# EAGLE design Zio Qwiic Air Pressure Sensor BMP280 (EAGLE 9.1.1)
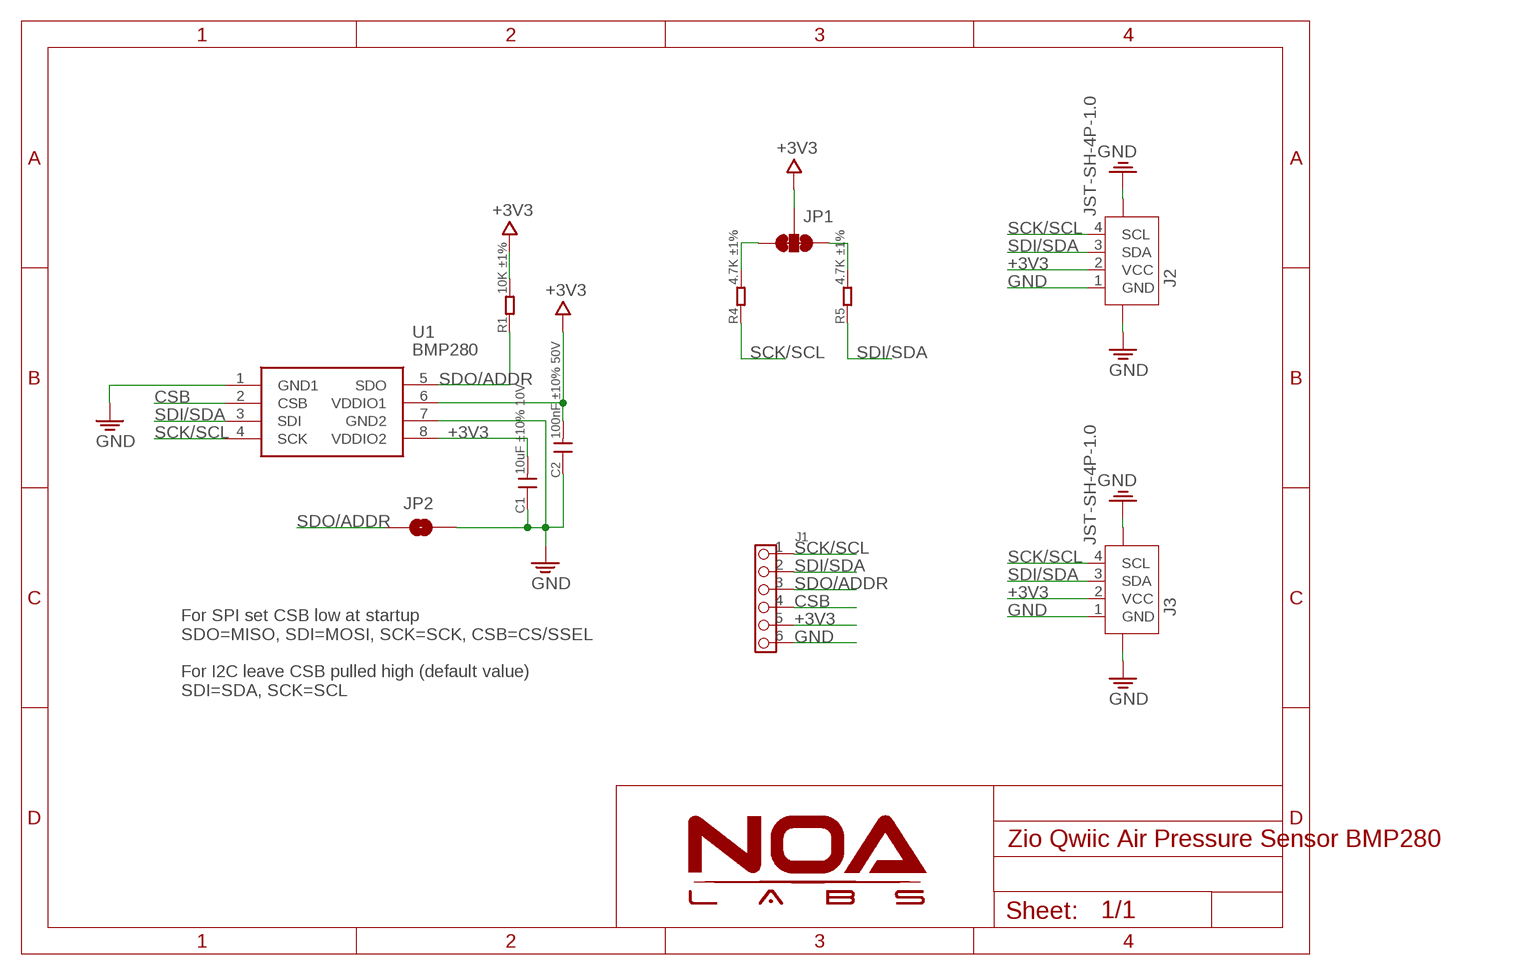
[diagram p0: schematic, sheet 1]

## Parts
C1  10uF ±10% 10V  C-0603  [C0603]
C2  100nF ±10% 50V  C-0603  [C0603]
J1  HEADER-6P-60/35MIL  [6P-2.54-60/35MIL]
J2  JST-SH-4P-1.0  [JST-SH-4P]
J3  JST-SH-4P-1.0  [JST-SH-4P]
JP1  SMT-JUMPER_3_2-NC_TRACE  [SMT-JUMPER_3_2-NC_TRACE]
JP2  JUMPER-SMT_2_NC_PASTE_NOCREM  [SMT-JUMPER_2_NC_PASTE_SILK_NOCREM]
R1  10K ±1%  R-0603  [R0603]
R4  4.7K ±1%  R-0603  [R0603]
R5  4.7K ±1%  R-0603  [R0603]
U1  BMP280  [8-PIN-METAL-LID-LGA]

## Nets
+3V3: C1.2 C2.2 J1.5 J2.2(VCC) J3.2(VCC) JP1.2 R1.2 U1.6(VDDIO1) U1.8(VDDIO2)
CSB: J1.4 U1.2(CSB)
GND: C1.1 C2.1 J1.6 J2.1(GND) J2.NC1 J2.NC2 J3.1(GND) J3.NC1 J3.NC2 JP2.2 U1.1(GND1) U1.7(GND2)
N$6: JP1.3 R4.2
N$8: JP1.1 R5.2
SCK/SCL: J1.1 J2.4(SCL) J3.4(SCL) R4.1 U1.4(SCK)
SDI/SDA: J1.2 J2.3(SDA) J3.3(SDA) R5.1 U1.3(SDI)
SDO/ADDR: J1.3 JP2.1 R1.1 U1.5(SDO)

## Notes on the sheet
- For SPI set CSB low at startup
  SDO=MISO, SDI=MOSI, SCK=SCK, CSB=CS/SSEL
  
  For I2C leave CSB pulled high (default value)
  SDI=SDA, SCK=SCL

## Library data of the parts
C1 C2 = RCL:C
J1 = Connector_NOA:HEADER-6P
J2 J3 = Connector:JST-SH-4P
JP1 = NOA-Jumpers:SMT-JUMPER_3_2-NC_TRACE
JP2 = NOA-Jumpers:JUMPER-SMT_2_NC_PASTE_NOCREM
R1 R4 R5 = RCL:R
U1 = IC_NOA:BMP280: Digital Pressure Sensor Source: Datasheet <https://ae-bst.resource.bosch.com/media/products/dokumente/bmp280/BST-BMP280-DS001-11.pdf>; ARROW_PART_NUMBER: bmp280; DESCRIPTION: Digital Pressure Sensor; HEIGHT: mm; MANUFACTURER_NAME: Bosch Sensortec; MANUFACTURER_PART_NUMBER: bmp280

## Board
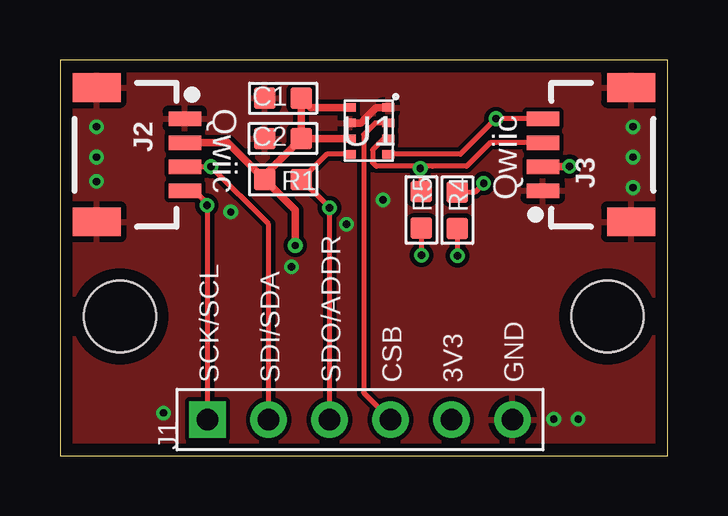
[diagram p1: board, top side]
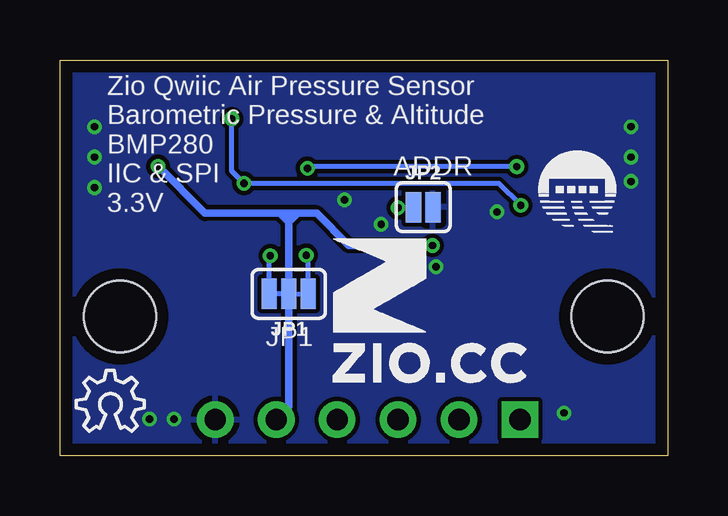
[diagram p2: board, bottom side, seen from below]

Size 25.32 x 16.5 mm. Coordinates in mm from the lower left corner, seen from the top.
Outline: 0,0 25.32,0 25.32,16.5 0,16.5 0,0
Copper layers (1*16): Top 0.035mm / dielectric 1.5mm / Bottom 0.035mm
Design rules "NOA Eagle Rule": minimum track width 7mil, minimum drill 12mil, track to track 7mil, track to pad 7mil, pad to pad 7mil, via to via 7mil, smd to smd 0mil, copper to edge 20mil, drill to drill 10mil, minimum pad ring 10mil, minimum via ring 6mil, stop-mask expansion 2mil, vias tented up to drill 25mil, thermal gap 10mil
Holes 3 mm at 2.5,5.8 22.82,5.8

### Footprints (pad centres in the part's own frame; a part is rotated, then mirrored left to right if it is on the bottom)
C0603 = smd 0.889 x 0.889: 1 -0.762,0; 2 0.762,0
6P-2.54-60/35MIL = drill 0.889 pad 1.524 square: 1 0,6.35 | drill 0.889 pad 1.524: 2 0,3.81; 3 0,1.27; 4 0,-1.27; 5 0,-3.81; 6 0,-6.35
JST-SH-4P = smd 0.6 x 1.35: 1 1.5,0; 2 0.5,0; 3 -0.5,0; 4 -1.5,0 | smd 1.2 x 2: NC1 -2.8,3.675; NC2 2.8,3.675
SMT-JUMPER_3_2-NC_TRACE = smd 0.635 x 1.27: 1 -0.813,0; 2 0,0; 3 0.813,0
SMT-JUMPER_2_NC_PASTE_SILK_NOCREM = smd 0.635 x 1.27: 1 -0.406,0; 2 0.406,0
R0603 = smd 0.889 x 0.889: 1 -0.762,0; 2 0.762,0
8-PIN-METAL-LID-LGA = smd 0.5 x 0.35: 1 0.8,0.975; 2 0.8,0.325; 3 0.8,-0.325; 4 0.8,-0.975; 5 -0.8,-0.975; 6 -0.8,-0.325; 7 -0.8,0.325; 8 -0.8,0.975

### Placement (x,y rotation side)
C1  9.3,14.9 0 top
C2  9.29,13.22 0 top
J1  12.5,1.5 90 top
J2  5.2,12.55 90 top
J3  20.12,12.55 270 top
JP1  15.79,6.74 180 bottom
JP2  10.19,10.36 0 bottom
R1  9.3,11.51 180 top
R4  16.56,10.24 270 top
R5  15.06,10.25 270 top
U1  12.87,13.54 0 top
U$4  [6MM]  13.97,3.05 0 bottom
U$5  [QWIIC-LOGO-BASIC]  3.81,10.92 0 bottom
U$6  [OSHW_6X100_NOTEXT]  24.64,1.02 0 bottom

### Tracks (layer width: path | path; a pad name or v marks a point on that pad's centre or on a via)
+3V3  (via drill 0.3)
  Top 0.305: U1.8 10.44,14.52 C1.2 C2.2 | C2.2 U1.6 | C2.2 8.53,11.71 R1.2 | J2.2 6.99,13.05 R1.2 | R1.2 9.8,10.24 v9.8,8.76 | v21.23,12.06 v21.22,12.05 J3.2
  Bottom 0.305: J1.5 15.79,2.02 JP1.2 15.79,9.74 | v9.8,8.76 13.28,8.76 14.63,10.11 15.39,10.11 | 15.39,10.11 16.15,10.11 | 16.15,10.11 19.28,10.11 v21.23,12.06 | 15.79,9.74 16.15,10.11 | 15.79,9.74 15.42,10.11 15.39,10.11
CSB
  Top 0.203: U1.2 13.13,13.87 12.65,13.39 12.65,2.62 J1.4
GND  (via drill 0.3)
  Top 0.305: U1.7 | U1.7 12.52,13.87 13.17,14.52 U1.1
  other vias: 7.11,10.16 11.94,9.65 13.46,10.67 9.65,7.87 20.57,1.52 21.59,1.52 4.32,1.78 1.52,13.72 1.52,12.45 1.52,11.43 23.88,13.72 23.88,12.45 23.88,11.18
  pour Top: 0,16.51 25.32,16.51 25.32,0 0,0
  pour Bottom: 0,16.51 25.32,16.51 25.32,0 0,0
N$6  (via drill 0.3)
  Top 0.203: R4.2 v16.56,8.33
  Bottom 0.203: JP1.3 16.6,8.29 v16.56,8.33
N$8  (via drill 0.3)
  Top 0.203: R5.2 v15.06,8.36
  Bottom 0.203: JP1.1 14.97,8.27 v15.06,8.36
SCK/SCL  (via drill 0.3)
  Top 0.203: J1.1 6.15,10.51 5.79,10.87 | J2.4 5.61,11.05 5.79,10.87 | J3.4 v18.16,14.05 16.68,12.57 U1.4 | R4.1 17.3,11 v17.65,11.35 | v6.12,10.44 6.12,10.54 5.79,10.87
  Bottom 0.203: v18.16,14.05 18.16,11.87 v17.65,11.35 7.04,11.35 v6.12,10.44
SDI/SDA  (via drill 0.3)
  Top 0.203: J1.2 8.69,9.65 v6.29,12.05 J2.3 | J3.3 17.93,13.05 16.94,12.06 15.54,12.06 | 15.54,12.06 15.27,12.06 | 15.27,12.06 15.14,12.06 14.86,12.06 | 14.86,12.06 13.18,12.06 13.03,12.22 13.03,12.75 13.5,13.22 U1.3 | 15.52,12.06 15.54,12.06 | R5.1 15.06,11.87 | 15.06,11.87 14.86,12.06 | 15.06,11.87 15.26,12.06 15.27,12.06 | v15.01,11.98 14.93,12.06 14.86,12.06
  Bottom 0.203: v6.29,12.05 14.95,12.05 v15.01,11.98
SDO/ADDR  (via drill 0.3)
  Top 0.203: U1.5 11.12,12.57 R1.1 v11.23,10.34 J1.3
  Bottom 0.203: JP2.1 10.62,10.34 v11.23,10.34

### Text on the board
tPlace: Qwiic | Qwiic | SCK/SCL | SDI/SDA | SDO/ADDR | CSB | 3V3 | GND
bPlace: ADDR | Zio Qwiic Air Pressure Sensor / Barometric Pressure & Altitude / BMP280 / IIC & SPI / 3.3V | JP1